# Altium schematic sheet Smart_Homes.SchDoc
size A4
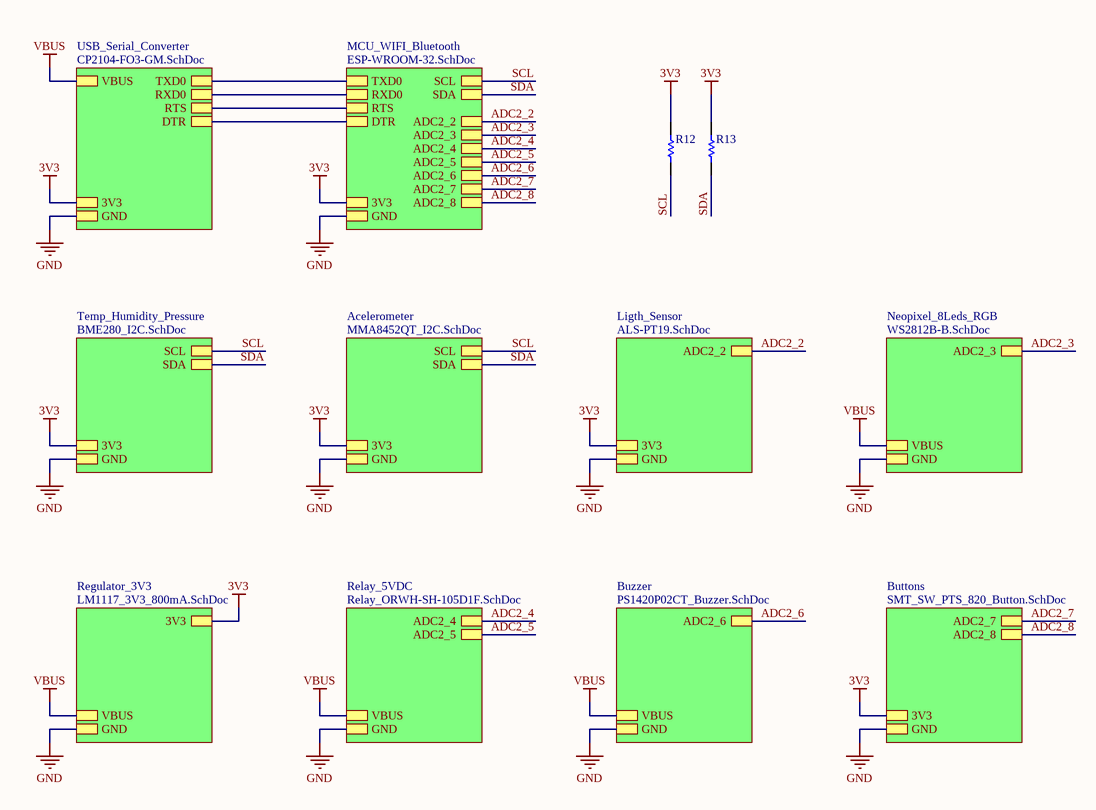
[diagram p0: Smart_Homes.SchDoc]

## Parts
R12  RK73B2ATTD103J  [RESC2013X60X30NL20T20]  (value not drawn)
R13  RK73B2ATTD103J  [RESC2013X60X30NL20T20]  (value not drawn)

## Sub-sheets
Acelerometer = MMA8452QT_I2C.SchDoc: SDA, SCL, GND, 3V3
Buttons = SMT_SW_PTS_820_Button.SchDoc: ADC2_8, GND, 3V3, ADC2_7
Buzzer = PS1420P02CT_Buzzer.SchDoc: GND, ADC2_6, VBUS
Ligth_Sensor = ALS-PT19.SchDoc: GND, 3V3, ADC2_2
MCU_WIFI_Bluetooth = ESP-WROOM-32.SchDoc: RTS, GND, RXD0, 3V3, SDA, DTR, TXD0, SCL, ADC2_3, ADC2_6, ADC2_2, ADC2_8, ADC2_7, ADC2_4, ADC2_5
Neopixel_8Leds_RGB = WS2812B-B.SchDoc: GND, VBUS, ADC2_3
Regulator_3V3 = LM1117_3V3_800mA.SchDoc: 3V3, GND, VBUS
Relay_5VDC = Relay_ORWH-SH-105D1F.SchDoc: ADC2_4, VBUS, GND, ADC2_5
Temp_Humidity_Pressure = BME280_I2C.SchDoc: GND, SDA, SCL, 3V3
USB_Serial_Converter = CP2104-FO3-GM.SchDoc: TXD0, DTR, RTS, RXD0, VBUS, 3V3, GND

## Nets
3V3: R12.2 R13.2 ; sheet Acelerometer/3V3, sheet Temp_Humidity_Pressure/3V3, sheet USB_Serial_Converter/3V3, sheet MCU_WIFI_Bluetooth/3V3, sheet Ligth_Sensor/3V3, sheet Regulator_3V3/3V3, sheet Buttons/3V3
GND: sheet Acelerometer/GND, sheet Temp_Humidity_Pressure/GND, sheet USB_Serial_Converter/GND, sheet MCU_WIFI_Bluetooth/GND, sheet Ligth_Sensor/GND, sheet Neopixel_8Leds_RGB/GND, sheet Regulator_3V3/GND, sheet Relay_5VDC/GND, sheet Buttons/GND, sheet Buzzer/GND
VBUS: sheet USB_Serial_Converter/VBUS, sheet Neopixel_8Leds_RGB/VBUS, sheet Regulator_3V3/VBUS, sheet Relay_5VDC/VBUS, sheet Buzzer/VBUS
ADC2_2: sheet MCU_WIFI_Bluetooth/ADC2_2, sheet Ligth_Sensor/ADC2_2
ADC2_3: sheet MCU_WIFI_Bluetooth/ADC2_3, sheet Neopixel_8Leds_RGB/ADC2_3
ADC2_4: sheet MCU_WIFI_Bluetooth/ADC2_4, sheet Relay_5VDC/ADC2_4
ADC2_5: sheet MCU_WIFI_Bluetooth/ADC2_5, sheet Relay_5VDC/ADC2_5
ADC2_6: sheet MCU_WIFI_Bluetooth/ADC2_6, sheet Buzzer/ADC2_6
ADC2_7: sheet MCU_WIFI_Bluetooth/ADC2_7, sheet Buttons/ADC2_7
ADC2_8: sheet MCU_WIFI_Bluetooth/ADC2_8, sheet Buttons/ADC2_8
SCL: R12.1 ; sheet Acelerometer/SCL, sheet Temp_Humidity_Pressure/SCL, sheet MCU_WIFI_Bluetooth/SCL
SDA: R13.1 ; sheet Acelerometer/SDA, sheet Temp_Humidity_Pressure/SDA, sheet MCU_WIFI_Bluetooth/SDA
(unnamed): sheet USB_Serial_Converter/TXD0, sheet MCU_WIFI_Bluetooth/TXD0
(unnamed): sheet USB_Serial_Converter/DTR, sheet MCU_WIFI_Bluetooth/DTR
(unnamed): sheet USB_Serial_Converter/RTS, sheet MCU_WIFI_Bluetooth/RTS
(unnamed): sheet USB_Serial_Converter/RXD0, sheet MCU_WIFI_Bluetooth/RXD0

## Library data of the parts
R12 R13 = CMP-2001-04657-1: 10 kOhms ±5% 0.25W, 1/4W Chip Resistor 0805 (2012 Metric) Automotive AEC-Q200, Moisture Resistant Thick Film; Manufacturer: KOA Speer; Part Number: RK73B2ATTD103J